# Altium schematic sheet power-v29.SchDoc: 29V SS and Buck Eval
size Letter; CheckedBy: J. Brinton; CompanyName: Signal Laboratories, Inc.; DrawnBy: J. Brinton; Engineer: J. Brinton; Address1: 3479 Edison Way; Address2: Menlo Park CA 94025; Address3: +1 (877) 778-8435; Address4: siglabs.com; Revision: 1; SheetNumber: 1; SheetTotal: 1
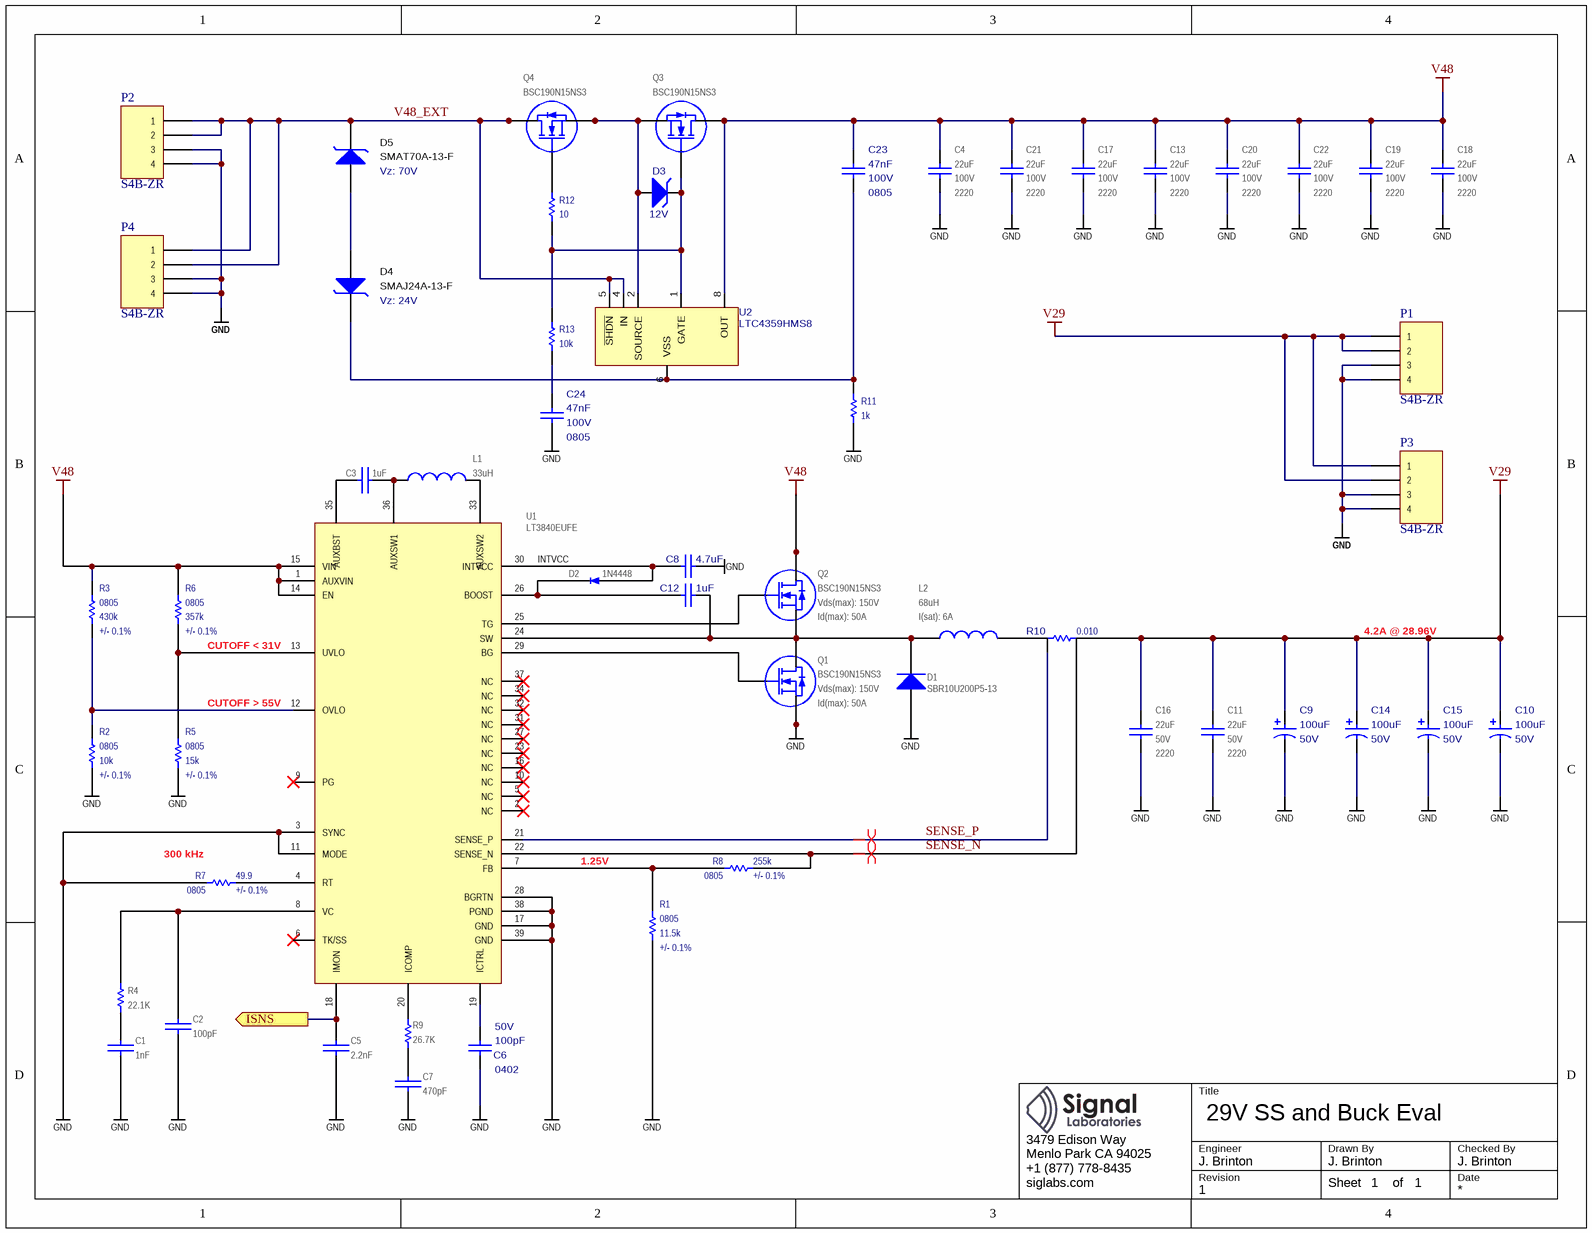
[diagram p0: power-v29.SchDoc]

## Parts
C1  value 1nF  [CAPC100X50X55L25N]  (hidden comment: GRM1555C1H102JA01)
C2  value 100pF  [CAPC100X50X55L25N]  (hidden comment: GRM1555C1H101JA01)
C3  value 1uF  [CAPC100X50X55L25N]  (hidden comment: GRM155R61A105KE15)
C4  value 22uF  Voltage: 100V  Package: 2220  [CAPC600X500X500L160N]  (hidden comment: CKG57NX7S2A226M500JJ)
C5  value 2.2nF  [CAPC100X50X55L25N]  (hidden comment: C0402C222J3GACTU)
C6  value 100pF  Package: 0402  Voltage: 50V  [CAPC160X80X90L20N]  (hidden comment: VJ0402A101KXA)
C7  value 470pF  [CAPC100X50X55L25N]  (hidden comment: GRM155R71H471JA01)
C8  value 4.7uF  [CAPC160X80X90L20N]  (hidden comment: TMK212B7475KG)
C9  value 100uF  Voltage: 50V  [CAPAE660X800D700L260X65N]  (hidden comment: EEE-FTH101XAP)
C10  value 100uF  Voltage: 50V  [CAPAE660X800D700L260X65N]  (hidden comment: EEE-FTH101XAP)
C11  value 22uF  Voltage: 50V  Package: 2220  [CAPC600X500X500L160N]  (hidden comment: CKG57NX7S1H226M500JJ)
C12  value 1uF  [CAPC160X80X90L20N]  (hidden comment: UMK212B7105KG)
C13  value 22uF  Voltage: 100V  Package: 2220  [CAPC600X500X500L160N]  (hidden comment: CKG57NX7S2A226M500JJ)
C14  value 100uF  Voltage: 50V  [CAPAE660X800D700L260X65N]  (hidden comment: EEE-FTH101XAP)
C15  value 100uF  Voltage: 50V  [CAPAE660X800D700L260X65N]  (hidden comment: EEE-FTH101XAP)
C16  value 22uF  Voltage: 50V  Package: 2220  [CAPC600X500X500L160N]  (hidden comment: CKG57NX7S1H226M500JJ)
C17  value 22uF  Voltage: 100V  Package: 2220  [CAPC600X500X500L160N]  (hidden comment: CKG57NX7S2A226M500JJ)
C18  value 22uF  Voltage: 100V  Package: 2220  [CAPC600X500X500L160N]  (hidden comment: CKG57NX7S2A226M500JJ)
C19  value 22uF  Voltage: 100V  Package: 2220  [CAPC600X500X500L160N]  (hidden comment: CKG57NX7S2A226M500JJ)
C20  value 22uF  Voltage: 100V  Package: 2220  [CAPC600X500X500L160N]  (hidden comment: CKG57NX7S2A226M500JJ)
C21  value 22uF  Voltage: 100V  Package: 2220  [CAPC600X500X500L160N]  (hidden comment: CKG57NX7S2A226M500JJ)
C22  value 22uF  Voltage: 100V  Package: 2220  [CAPC600X500X500L160N]  (hidden comment: CKG57NX7S2A226M500JJ)
C23  value 47nF  Package: 0805  Voltage: 100V  [CAPC200X125X145L45N]  (hidden comment: VJ0805Y473KXB)
C24  value 47nF  Package: 0805  Voltage: 100V  [CAPC200X125X145L45N]  (hidden comment: VJ0805Y473KXB)
D1  SBR10U200P5-13  [DIODES_POWERDI5]
D2  Alternative P/N: 1N4448  [SOD323]  (hidden comment: 1N4448HWS-7-F)
D3  Vz: 12V  [SOD123]  (hidden comment: DDZ12BQ-7)
D4  SMAJ24A-13-F  Vz: 24V  [SMA]
D5  SMAT70A-13-F  Vz: 70V  [SMA]
L1  value 33uH  [ME3220]  (hidden comment: ME3220-333KL)
L2  value 68uH  I(sat): 6A  [HCM1A1707]  (hidden comment: HCM1A1707-680-R)
P1  S4B-ZR  [S4B-ZR]
P2  S4B-ZR  [S4B-ZR]
P3  S4B-ZR  [S4B-ZR]
P4  S4B-ZR  [S4B-ZR]
Q1  BSC190N15NS3  Vds(max): 150V  Id(max): 50A  [TDSON-8]
Q2  BSC190N15NS3  Vds(max): 150V  Id(max): 50A  [TDSON-8]
Q3  BSC190N15NS3  [TDSON-8]
Q4  BSC190N15NS3  [TDSON-8]
R1  value 11.5k  Tolerance: +/- 0.1%  Package: 0805  [RESC2012X70N]  (hidden comment: RT0805BRD0711K5L)
R2  value 10k  Tolerance: +/- 0.1%  Package: 0805  [RESC2012X70N]  (hidden comment: RG2012P-103-B-T5)
R3  value 430k  Tolerance: +/- 0.1%  Package: 0805  [RESC2012X70N]  (hidden comment: RT0805BRD07430KL)
R4  value 22.1K  [RESC1005X40N]  (hidden comment: ERJ-2RKF2212X)
R5  value 15k  Tolerance: +/- 0.1%  Package: 0805  [RESC2012X70N]  (hidden comment: RG2012P-153-B-T5)
R6  value 357k  Tolerance: +/- 0.1%  Package: 0805  [RESC2012X70N]  (hidden comment: RT0805BRD07357KL)
R7  value 49.9  Tolerance: +/- 0.1%  Package: 0805  [RESC2012X70N]  (hidden comment: RT0805BRD0749R9L)
R8  value 255k  Tolerance: +/- 0.1%  Package: 0805  [RESC2012X70N]  (hidden comment: PTN0805E2553BST1)
R9  value 26.7K  [RESC1005X40N]  (hidden comment: ERJ-2RKF2672X)
R10  value 0.010  [LVK20]  (hidden comment: LVK20R010DER)
R11  value 1k  [RESC2012X70N]  (hidden comment: RC0805FR-071KL)
R12  value 10  [RESC2012X70N]  (hidden comment: RC0805FR-0710RL)
R13  value 10k  [RESC2012X70N]  (hidden comment: RC0805FR-0710KL)
U1  LT3840EUFE  [QFN39P40_600X400X80L40X20T465X265N]
U2  LTC4359HMS8  [MSOP8]

## Ports
ISNS (out)

## Nets
GND: C1.2 C2.1 C4.1 C5.2 C6.2 C7.1 C8.2 C9.2 C10.2 C11.1 C13.1 C14.2 C15.2 C16.1 C17.1 C18.1 C19.1 C20.1 C21.1 C22.1 C24.2 D1.A P1.3 P1.4 P2.3 P2.4 P3.3 P3.4 P4.3 P4.4 Q1.1(S) Q1.2(S) Q1.3(S) R1.1 R2.1 R5.1 R7.2 R11.1 U1.3(SYNC) U1.11(MODE) U1.17(GND) U1.28(BGRTN) U1.38(PGND) U1.39(GND)
V29: C9.1 C10.1 C11.2 C14.1 C15.1 C16.2 P1.1 P1.2 P3.1 P3.2 R10.1
V48: C4.2 C13.2 C17.2 C18.2 C19.2 C20.2 C21.2 C22.2 C23.1 Q2.5(D) Q2.6(D) Q2.7(D) Q2.8(D) Q2.9(D) Q3.5(D) Q3.6(D) Q3.7(D) Q3.8(D) Q3.9(D) R3.2 R6.2 U1.1(AUXVIN) U1.14(EN) U1.15(VIN) U2.8(OUT)
INTVCC: C8.1 D2.A U1.30(INTVCC)
ISNS: C5.1 U1.18(IMON) ; port ISNS
SENSE_N: R8.1 R10.2 U1.22(SENSE_N)
SENSE_P: R10.3 U1.21(SENSE_P)
V48_EXT: D5.2(K) P2.1 P2.2 P4.1 P4.2 Q4.5(D) Q4.6(D) Q4.7(D) Q4.8(D) Q4.9(D) U2.4(IN) U2.5(~{SHDN})
NetC1_1: C1.1 R4.1
NetC2_2: C2.2 R4.2 U1.8(VC)
NetC3_1: C3.1 L1.1 U1.36(AUXSW1)
NetC3_2: C3.2 U1.35(AUXBST)
NetC6_1: C6.1 U1.19(ICTRL)
NetC7_2: C7.2 R9.2
NetC12_1: C12.1 D2.K U1.26(BOOST)
NetC12_2: C12.2 D1.K L2.1 Q1.5(D) Q1.6(D) Q1.7(D) Q1.8(D) Q1.9(D) Q2.1(S) Q2.2(S) Q2.3(S) U1.24(SW)
NetC23_2: C23.2 D4.2(K) R11.2 U2.6(VSS)
NetC24_1: C24.1 R13.1
NetD3_1: D3.1(A) Q3.1(S) Q3.2(S) Q3.3(S) Q4.1(S) Q4.2(S) Q4.3(S) U2.2(SOURCE)
NetD3_2: D3.2(K) Q3.4(G) R12.1 R13.2 U2.1(GATE)
NetD4_1: D4.1(A) D5.1(A)
NetL1_2: L1.2 U1.33(AUXSW2)
NetL2_2: L2.2 R10.4
NetQ1_4: Q1.4(G) U1.29(BG)
NetQ2_4: Q2.4(G) U1.25(TG)
NetQ4_4: Q4.4(G) R12.2
NetR1_2: R1.2 R8.2 U1.7(FB)
NetR2_2: R2.2 R3.1 U1.12(OVLO)
NetR5_2: R5.2 R6.1 U1.13(UVLO)
NetR7_1: R7.1 U1.4(RT)
NetR9_1: R9.1 U1.20(ICOMP)

Not connected (* = marked no-connect by the designer): U1 2(NC)* 5(NC)* 6(TK/SS)* 9(PG)* 10(NC)* 16(NC)* 23(NC)* 27(NC)* 31(NC)* 32(NC)* 34(NC)* 37(NC)*; U2 3(NC) 7(NC)

## Layout directives
differential pair: SENSE_N, SENSE_P

## Notes on the sheet
- CUTOFF < 31V
- 4.2A @ 28.96V
- CUTOFF > 55V
- (near R7) 300 kHz
- 1.25V
- Title
- Engineer
- Revision
- Drawn By
- Checked By
- Date
- Sheet
- of

## Library data of the parts
C1 = CAP: Ceramic Capacitor 1nF ±5% 50V NP0 0402; Manufacturer: Murata; Tr: -55:125; Manufacturer P/N: GRM1555C1H102JA01; Voltage: 50V; Package: 0402; Tolerance: ±5%
C2 = CAP: Ceramic Capacitor 100pF ±5% 50V NP0 0402; Manufacturer: Murata; Tr: -55:125; Manufacturer P/N: GRM1555C1H101JA01; Voltage: 50V; Package: 0402; Tolerance: ±5%
C3 = CAP: Ceramic Capacitor 1uF ±10% 10V X5R 0402; Manufacturer: Murata; Tr: -55:125; Manufacturer P/N: GRM155R61A105KE15; Package: 0402; Tolerance: ±10%; Voltage: 10V
C4 C13 C17-C22 = CAP: Ceramic Capacitor 22uF ±20% 100V X7S Stacked; Manufacturer: TDK; Tr: -55:125; Manufacturer P/N: CKG57NX7S2A226M500JJ; Tolerance: ±20%
C5 = CAP: Ceramic Capacitor 2.2nF ±5% 25V NP0 0402; Manufacturer: Kemet; Tr: -55:125; Manufacturer P/N: C0402C222J3GACTU; Package: 0402; Tolerance: ±5%; Voltage: 25V
C6 = VJ0402A101KXA: Ceramic Capacitor 100pF ±10% 50V C0G 0402; Manufacturer: Vishay; Tr: -55:150; pF: 100; Manufacturer P/N: VJ0402A101KXA; Tolerance: ±10%
C7 = CAP: Ceramic Capacitor 470pF ±5% 50V X7R 0402; Manufacturer: Murata; Tr: -55:125; Manufacturer P/N: GRM155R71H471JA01; Voltage: 50V; Package: 0402; Tolerance: ±5%
C8 = TMK212B7475KG: Ceramic Capacitor 4.7uF ±10% 25V X7R 0805; Manufacturer: Taiyo Yuden; pF: 4700000; Notes: stock needs validation; Manufacturer P/N: TMK212B7475KG; Tolerance: ±10%; Tr: *; Package: 0805; Voltage: 25V
C9 C10 C14 C15 = CAP_POL: Aluminum Electrolytic Capacitor 100uF ±20% 50V; Manufacturer: Panasonic; Tr: -55:105; Manufacturer P/N: EEE-FTH101XAP; Tolerance: ±20%; Package: 6.3mm Radial
C11 C16 = CAP: Ceramic Capacitor 22uF ±20% 50V X7S Stacked; Manufacturer: TDK; Tr: -55:125; Manufacturer P/N: CKG57NX7S1H226M500JJ; Tolerance: ±20%
C12 = UMK212B7105KG: Ceramic Capacitor 1uF ±10% 50V X7R 0805; Manufacturer: Taiyo Yuden; pF: 1000000; Manufacturer P/N: UMK212B7105KG; Tolerance: ±10%; Tr: *; Package: 0805; Voltage: 50V
C23 C24 = VJ0805Y473KXB: Ceramic Capacitor 47nF ±10% 100V X7R 0805; Manufacturer: Vishay; Tr: -55:150; pF: 47000; Manufacturer P/N: VJ0805Y473KXB; Tolerance: ±10%
D1 = PDS5100H: Schottky Diode 200V 10A SMD; Manufacturer: Diodes Inc; Manufacturer P/N: SBR10U200P5-13; Current: 10A; Reverse Voltage (max): 200V
D2 = 1N4448HWS-7-F: Schottky Diode 80V 250mA SOD323; Manufacturer: Diodes, Inc.; Manufacturer P/N: 1N4448HWS-7-F; Package: SOD323
D3 = ZENER: Zener Diode 12V 370mW SOD-123; Manufacturer: Diodes, Inc.; Manufacturer P/N: DDZ12BQ-7; Package: SOD-123
D4 = TVS: TVS Diode 24V/38.9V SMA; Manufacturer: Diodes, Inc.; Manufacturer P/N: SMAJ24A-13-F
D5 = TVS: TVS Diode 70V/100V SMA; Manufacturer: Diodes, Inc.; Manufacturer P/N: SMAT70A-13-F
L1 = COIL: Wirewound Power Inductor 33uH ±10% 500mA SMD; Manufacturer: Coilcraft; Tr: -40:85; Manufacturer P/N: ME3220-333KL; I(sat): 500mA; Package: *; Tolerance: ±10%
L2 = COIL: Fixed Inductor 68uH, 6A(sat), SMD; Manufacturer: Eaton; Manufacturer P/N: HCM1A1707-680-R
P1-P4 = S4B-ZR: 1.5mm pitch right angle 6-position; Manufacturer: JST; Manufacturer P/N: S4B-ZR
Q1 Q2 = BSC190N15NS3: MOSFET N-Channel Enhancement Mode; Manufacturer: Infineon; Rds(on): 19mOhm; Manufacturer P/N: BSC190N15NS3
Q3 Q4 = BSC190N15NS3: MOSFET N-Channel Enhancement Mode; Manufacturer: Infineon; Vds(max): 150V; Id(max): 50A; Rds(on): 19mOhm; Manufacturer P/N: BSC190N15NS3
R1 = RES: Thin Film Resistor 11.5k +/-0.1% SMD 0805; Manufacturer: Yageo; Tr: -55:155; Tcr: *; Manufacturer P/N: RT0805BRD0711K5L; Alternatives: *; Voltage: *; Power: *
R2 = RES: Thin Film Resistor 10k +/-0.1% SMD 0805; Manufacturer: Susumu; Tr: -55:155; Tcr: *; Manufacturer P/N: RG2012P-103-B-T5; Alternatives: *; Voltage: *; Power: *
R3 = RES: Thin Film Resistor 430k +/-0.1% SMD 0805; Manufacturer: Yageo; Tr: -55:155; Tcr: *; Manufacturer P/N: RT0805BRD07430KL; Alternatives: *; Voltage: *; Power: *
R4 = RES 0402: Thick Film Resistor 22.1k ±1% 0402; Manufacturer: Panasonic; Tr: -55:155; Package: 0402; Manufacturer P/N: ERJ-2RKF2212X; Tolerance: ±1%
R5 = RES: Thin Film Resistor 15k +/-0.1% SMD 0805; Manufacturer: Susumu; Tr: -55:155; Tcr: *; Manufacturer P/N: RG2012P-153-B-T5; Alternatives: *; Voltage: *; Power: *
R6 = RES: Thin Film Resistor 357k +/-0.1% SMD 0805; Manufacturer: Yageo; Tr: -55:155; Tcr: *; Manufacturer P/N: RT0805BRD07357KL; Alternatives: *; Voltage: *; Power: *
R7 = RES: Thin Film Resistor 49 +/-0.1% SMD 0805; Manufacturer: Yageo; Tr: -55:155; Tcr: *; Manufacturer P/N: RT0805BRD0749R9L; Alternatives: *; Voltage: *; Power: *
R8 = RES: Thin Film Resistor 255k +/-0.1% SMD 0805; Manufacturer: Vishay; Tr: -55:155; Tcr: *; Manufacturer P/N: PTN0805E2553BST1; Alternatives: *; Voltage: *; Power: *
R9 = RES 0402: Thick Film Resistor 26.7k ±1% 0402; Manufacturer: Panasonic; Tr: -55:155; Package: 0402; Manufacturer P/N: ERJ-2RKF2672X; Tolerance: ±1%
R10 = CST0612-FC-R002E: Current Sense Resistor 10 mOhms +/-0.5% SMD 4-Terminal; Manufacturer: Ohmite; Tr: -40:+125; Tolerance: +/-0.5%; Manufacturer P/N: LVK20R010DER
R11 = RES: Thin Film Resistor 1k +/-1% SMD 0805; Manufacturer: Yageo; Tr: -55:155; Voltage: 150V; Tcr: *; Tolerance: +/- 1%; Manufacturer P/N: RC0805FR-071KL; Alternatives: *; Power: *; Package: 0805
R12 = RES: Thin Film Resistor 10 +/-1% SMD 0805; Manufacturer: Yageo; Tr: -55:155; Voltage: 150V; Tcr: *; Tolerance: +/- 1%; Manufacturer P/N: RC0805FR-0710RL; Alternatives: *; Power: *; Package: 0805
R13 = RES: Thin Film Resistor 10k +/-1% SMD 0805; Manufacturer: Yageo; Tr: -55:155; Voltage: 150V; Tcr: *; Tolerance: +/- 1%; Manufacturer P/N: RC0805FR-0710KL; Alternatives: *; Power: *; Package: 0805
U1 = LT3840EUFE: Synchronous Regulator Controller; Manufacturer: Linear Technologies; Alternative P/N: LT3840IUFE; Manufacturer P/N: LT3840EUFE
U2 = LTC4359HMS8: Ideal Diode Controller; Manufacturer: Linear Technology; Manufacturer P/N: LTC4359HMS8